# EAGLE design TASK8 (EAGLE 9.6.2)
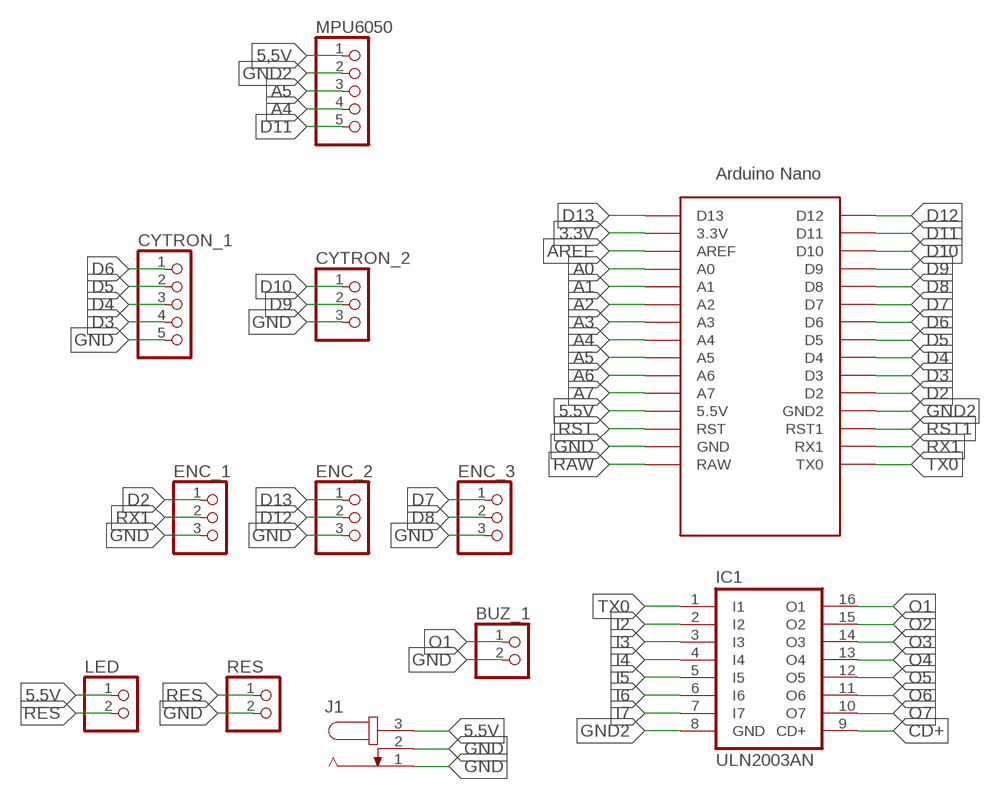
[diagram p0: schematic, sheet 1]

## Parts
BUZ_1  PINHD-1X2  [1X02]
CYTRON_1  PINHD-1X5  [1X05]
CYTRON_2  PINHD-1X3  [1X03]
ENC_1  PINHD-1X3  [1X03]
ENC_2  PINHD-1X3  [1X03]
ENC_3  PINHD-1X3  [1X03]
IC1  ULN2003AN  [DIL16]
J1  JACK-PLUG0  [SPC4077]
LED  PINHD-1X2  [1X02]
MPU6050  PINHD-1X5  [1X05]
RES  PINHD-1X2  [1X02]
U$1  ARDUINO_NANO  [NANO]

## Nets
3.3V: U$1.3.3V
5,5V: MPU6050.1
5.5V: J1.3 LED.1 U$1.5V(5.5V)
A0: U$1.A0
A1: U$1.A1
A2: U$1.A2
A3: U$1.A3
A4: MPU6050.4 U$1.A4
A5: MPU6050.3 U$1.A5
A6: U$1.A6
A7: U$1.A7
AREF: U$1.AREF
CD+: IC1.9(CD+)
D2: ENC_1.1 U$1.D2
D3: CYTRON_1.4 U$1.D3
D4: CYTRON_1.3 U$1.D4
D5: CYTRON_1.2 U$1.D5
D6: CYTRON_1.1 U$1.D6
D7: ENC_3.1 U$1.D7
D8: ENC_3.2 U$1.D8
D9: CYTRON_2.2 U$1.D9
D10: CYTRON_2.1 U$1.D10
D11: MPU6050.5 U$1.D11
D12: ENC_2.2 U$1.D12
D13: ENC_2.1 U$1.D13
GND: BUZ_1.2 CYTRON_1.5 CYTRON_2.3 ENC_1.3 ENC_2.3 ENC_3.3 J1.1 J1.2 RES.2 U$1.GND
GND2: IC1.8(GND) MPU6050.2 U$1.GND1(GND2)
I2: IC1.2(I2)
I3: IC1.3(I3)
I4: IC1.4(I4)
I5: IC1.5(I5)
I6: IC1.6(I6)
I7: IC1.7(I7)
O1: BUZ_1.1 IC1.16(O1)
O2: IC1.15(O2)
O3: IC1.14(O3)
O4: IC1.13(O4)
O5: IC1.12(O5)
O6: IC1.11(O6)
O7: IC1.10(O7)
RAW: U$1.RAW
RES: LED.2 RES.1
RST: U$1.RST
RST1: U$1.RST1
RX1: ENC_1.2 U$1.RX1
TX0: IC1.1(I1) U$1.TX0

## Library data of the parts
BUZ_1 LED RES = MIA-Training:PINHD-1X2: PIN HEADER
CYTRON_1 MPU6050 = MIA-Training:PINHD-1X5: PIN HEADER
CYTRON_2 ENC_1-ENC_3 = MIA-Training:PINHD-1X3: PIN HEADER
IC1 = MIA-Training:ULN2003A: DRIVER ARRAY
J1 = con-jack:JACK-PLUG: DC POWER JACK Power Jack, DC, Right Angle, Through Hole, Rated 5A at 16VDC, PC Terminals Distributor: Farnell (www.Farnell.de) Drawing: 84N1161.pdf / 84N1162.pdf Manufacturer: SPC Technology (www.spctechnology.com) Type: SPC4077 / SPC 4078; OC_FARNELL: unknown; OC_NEWARK: unknown
U$1 = MIA-Training:ARDUINO_NANO: Arduino Nano

## Board
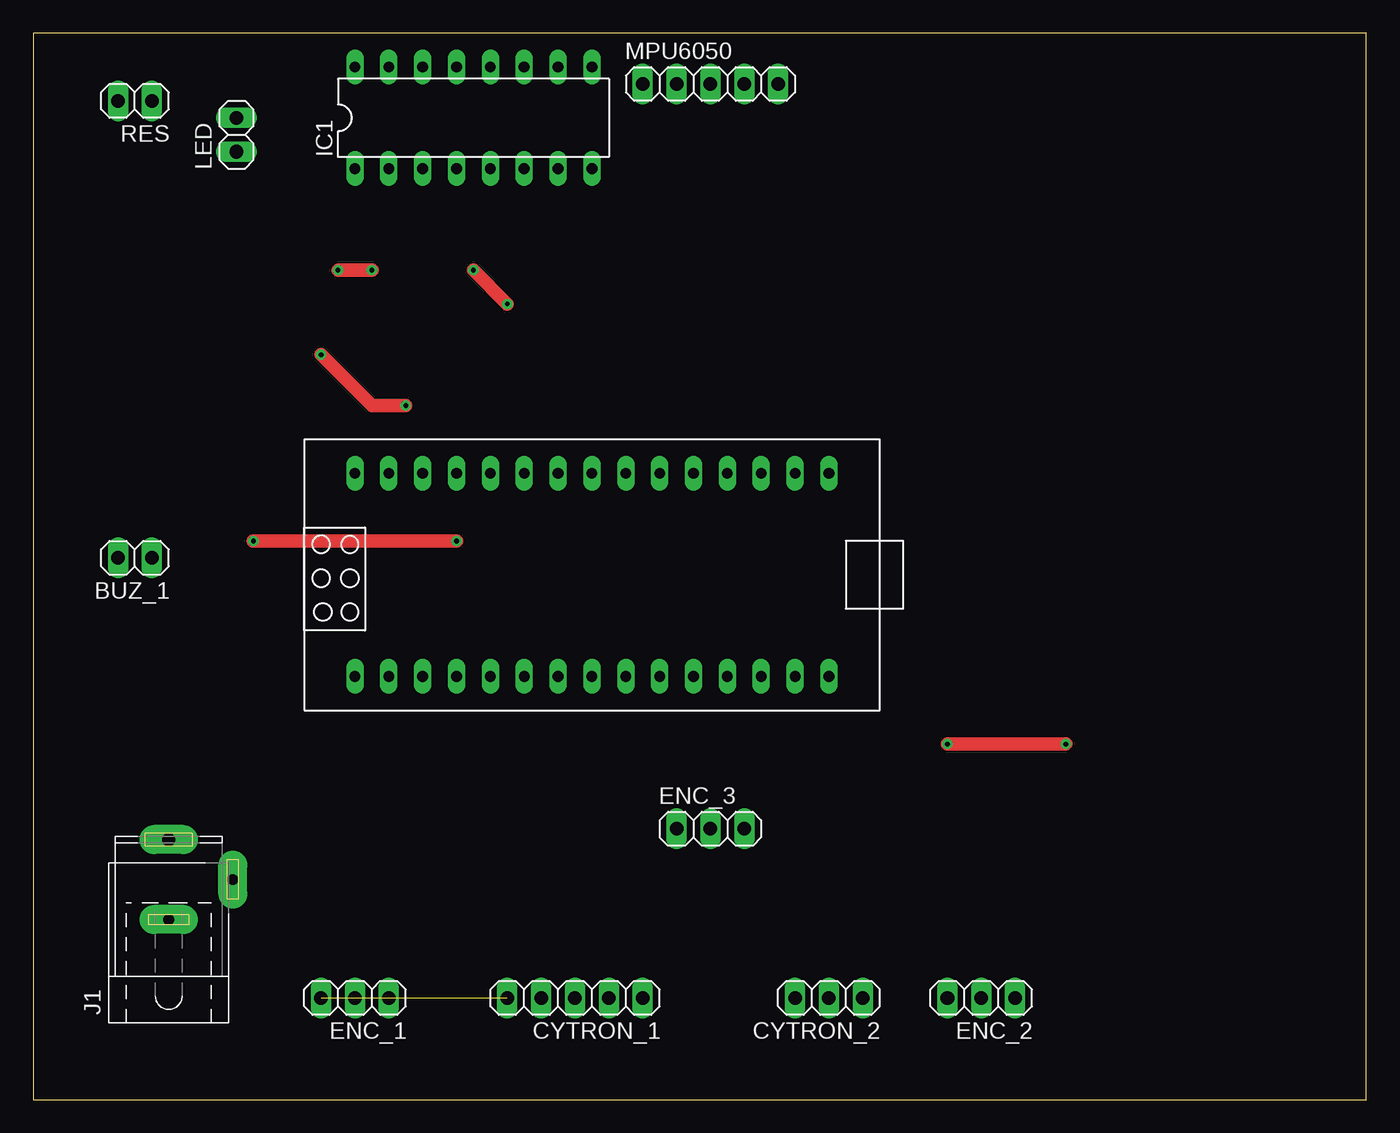
[diagram p1: board, top side]
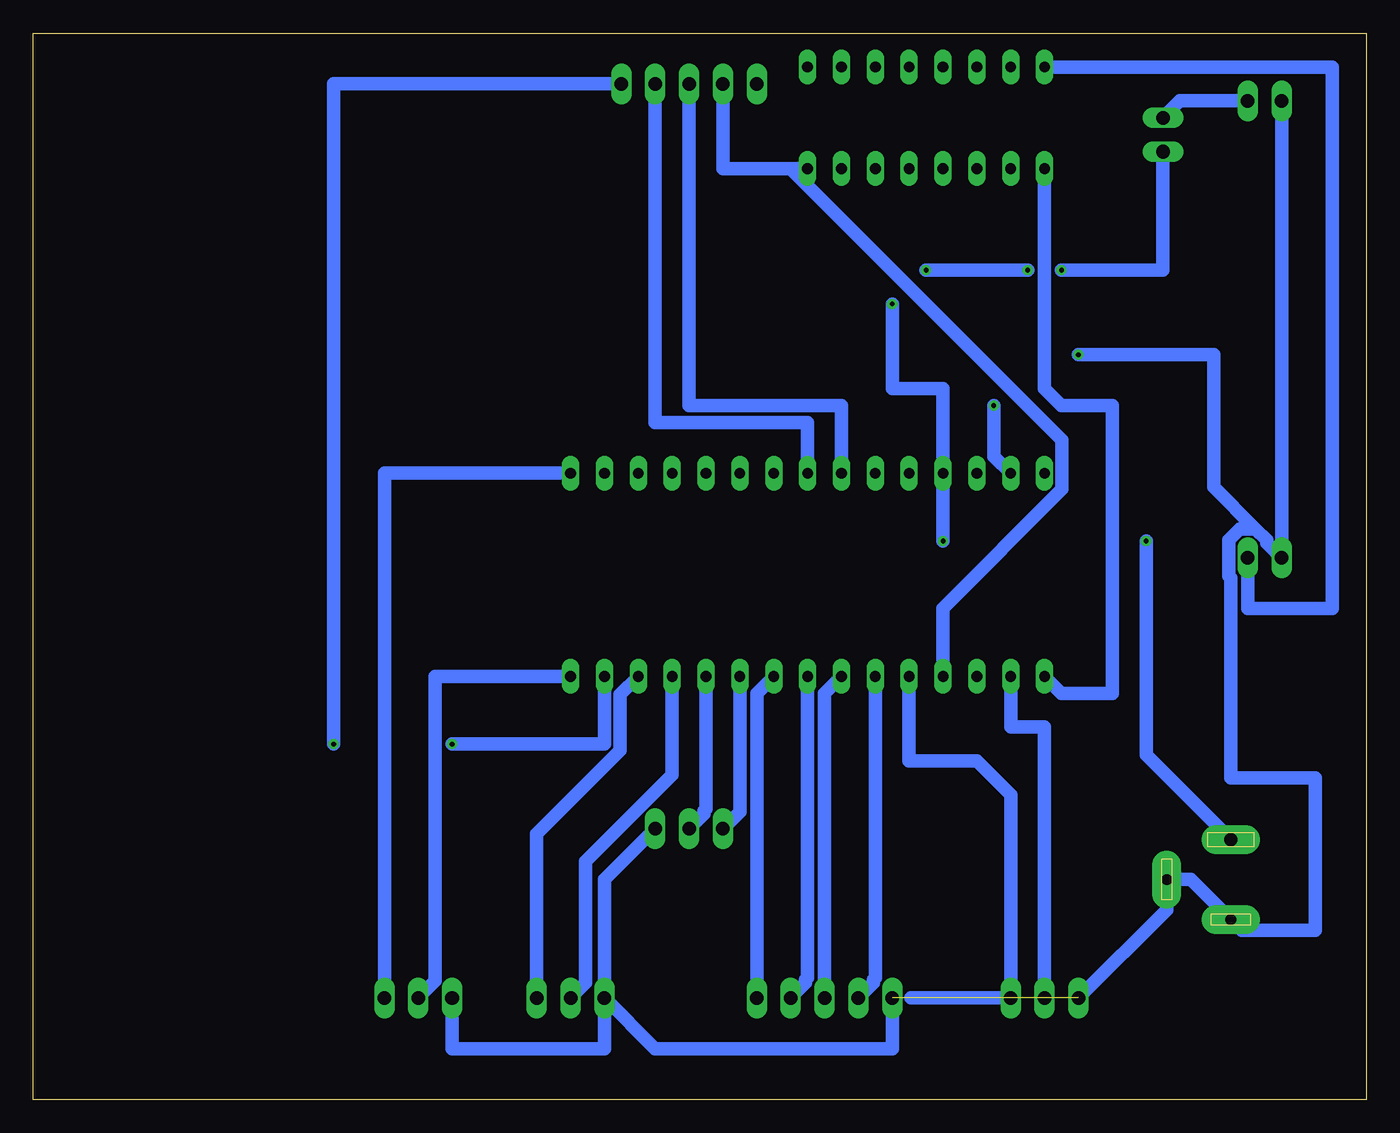
[diagram p2: board, bottom side, seen from below]

Size 100 x 80 mm. Coordinates in mm from the lower left corner, seen from the top.
Outline: 0,0 100,0 100,80 0,80 0,0
Copper layers (1*16): Top 0.035mm / dielectric 1.5mm / Bottom 0.035mm
Design rules "default": minimum track width 6mil, minimum drill 0.35mm, track to track 6mil, track to pad 6mil, pad to pad 6mil, via to via 6mil, smd to smd 6mil, copper to edge 40mil, drill to drill 6mil, minimum pad ring 10mil, minimum via ring 8mil, stop-mask expansion 4mil, vias tented up to drill 0mil, thermal gap 10mil

### Footprints (pad centres in the part's own frame; a part is rotated, then mirrored left to right if it is on the bottom)
1X02 = drill 1.016 long: 1 -1.27,0; 2 1.27,0
1X05 = drill 1.016 long: 1 -5.08,0; 2 -2.54,0; 3 0,0; 4 2.54,0; 5 5.08,0
1X03 = drill 1.016 long: 1 -2.54,0; 2 0,0; 3 2.54,0
DIL16 = drill 0.813 long: 1 -8.89,-3.81; 2 -6.35,-3.81; 3 -3.81,-3.81; 4 -1.27,-3.81; 5 1.27,-3.81; 6 3.81,-3.81; 7 6.35,-3.81; 8 8.89,-3.81; 9 8.89,3.81; 10 6.35,3.81; 11 3.81,3.81; 12 1.27,3.81; 13 -1.27,3.81; 14 -3.81,3.81; 15 -6.35,3.81; 16 -8.89,3.81
SPC4077 = drill 0.8 pad 2.184 long: 1 -3,0; 2 0,-4.8 | drill 1 pad 2.184 long: 3 3,0
NANO = drill 0.8 long: 3.3V -10.16,24.13; 5V -10.16,-1.27; A0 -10.16,19.05; A1 -10.16,16.51; A2 -10.16,13.97; A3 -10.16,11.43; A4 -10.16,8.89; A5 -10.16,6.35; A6 -10.16,3.81; A7 -10.16,1.27; AREF -10.16,21.59; D2 5.08,1.27; D3 5.08,3.81; D4 5.08,6.35; D5 5.08,8.89; D6 5.08,11.43; D7 5.08,13.97; D8 5.08,16.51; D9 5.08,19.05; D10 5.08,21.59; D11 5.08,24.13; D12 5.08,26.67; D13 -10.16,26.67; GND -10.16,-6.35; GND1 5.08,-1.27; RAW -10.16,-8.89; RST -10.16,-3.81; RST1 5.08,-3.81; RX1 5.08,-6.35; TX0 5.08,-8.89

### Placement (x,y rotation side)
BUZ_1  7.62,40.64 180 top
CYTRON_1  40.64,7.62 180 top
CYTRON_2  59.69,7.62 180 top
ENC_1  24.13,7.62 180 top
ENC_2  71.12,7.62 180 top
ENC_3  50.8,20.32 0 top
IC1  33.02,73.66 0 top
J1  10.16,16.51 90 top
LED  15.24,72.39 90 top
MPU6050  50.8,76.2 0 top
RES  7.62,74.93 180 top
U$1  33.02,36.83 270 top

### Tracks (layer width: path | path; a pad name or v marks a point on that pad's centre or on a via)
5.5V  (via drill 0.35)
  Top 1.016: v22.86,62.23 v25.4,62.23 | v33.02,62.23 v35.56,59.69 | v16.51,41.91 v31.75,41.91
  Bottom 1.016: LED.1 15.24,62.23 v22.86,62.23 | v25.4,62.23 v33.02,62.23 | v35.56,59.69 35.56,53.34 31.75,53.34 U$1.5V v31.75,41.91 | J1.3 16.51,25.86 v16.51,41.91
A4
  Bottom 1.016: MPU6050.4 53.34,50.8 41.91,50.8 U$1.A4
A5
  Bottom 1.016: U$1.A5 39.37,52.07 50.8,52.07 MPU6050.3
D2
  Bottom 1.016: U$1.D2 34.29,25.4 29.21,25.4 26.67,22.86 ENC_1.1 34.14,7.62
D3
  Bottom 1.016: CYTRON_1.4 36.98,8.74 36.98,8.97 36.83,9.12 U$1.D3
D4
  Bottom 1.016: U$1.D4 40.64,30.48 CYTRON_1.3
D5
  Bottom 1.016: CYTRON_1.2 42.06,8.74 42.06,8.97 41.91,9.12 U$1.D5
D6
  Bottom 1.016: U$1.D6 45.72,30.48 CYTRON_1.1
D7
  Bottom 1.016: ENC_3.1 46.99,21.59 U$1.D7
D8
  Bottom 1.016: ENC_3.2 49.68,21.44 49.68,21.67 49.53,21.82 U$1.D8
D9
  Bottom 1.016: CYTRON_2.2 58.57,8.74 58.57,17.86 52.07,24.36 U$1.D9
D10
  Bottom 1.016: U$1.D10 55.98,30.38 55.98,26.19 62.23,19.94 CYTRON_2.1
D11  (via drill 0.35)
  Top 1.016: v68.58,26.67 v77.47,26.67
  Bottom 1.016: U$1.D11 57.15,26.67 v68.58,26.67 | v77.47,26.67 77.47,76.2 MPU6050.5
D12
  Bottom 1.016: ENC_2.2 69.85,8.89 69.85,31.75 U$1.D12
D13
  Bottom 1.016: ENC_2.1 73.66,46.99 U$1.D13
GND  (via drill 0.35)  (1 unrouted)
  Top 1.016: v21.59,55.88 25.4,52.07 v27.94,52.07
  Bottom 1.016: ENC_1.3 14.96,14.25 J1.2 13.16,16.51 J1.1 9.35,12.7 3.81,12.7 3.81,24.13 10.16,24.13 10.16,39.14 10.31,39.29 10.31,41.99 9.48,42.82 8.3,42.82 | ENC_3.3 57.15,16.51 CYTRON_2.3 | CYTRON_2.3 53.34,3.81 35.56,3.81 CYTRON_1.5 | ENC_2.3 68.58,3.81 57.15,3.81 CYTRON_2.3 | RES.2 BUZ_1.2 7.47,41.76 7.47,41.99 8.3,42.82 | 8.3,42.82 11.43,45.95 11.43,55.88 v21.59,55.88 | v27.94,52.07 27.94,48.26 U$1.GND
GND2
  Bottom 1.016: MPU6050.2 48.26,69.85 43.18,69.85 | 43.18,69.85 IC1.8 | U$1.GND1 31.75,36.86 22.82,45.79 22.82,49.49 43.18,69.85
O1
  Bottom 1.016: IC1.16 2.54,77.47 2.54,36.83 8.89,36.83 BUZ_1.1
RES
  Bottom 1.016: LED.2 13.97,74.93 RES.1
RX1
  Bottom 1.016: U$1.RX1 26.67,27.94 24.13,27.94 ENC_1.2
TX0
  Bottom 1.016: IC1.1 24.13,53.34 22.86,52.07 19.05,52.07 19.05,30.48 22.86,30.48 U$1.TX0